# Altium project Industrial-Controller.PrjPcb (part 3 of 3)

## Sheet Industrial-Controller_Power.SchDoc: Power
size 279 x 215 mm; Date: not used; ApprovedBy: not used; CheckedBy: not used; Author: not used; CompanyName: MRobot, LCC; DrawnBy: not used; Engineer: Podlesnyi Vasilii; Organization: not used; Address1: nab. reki Karpovki, d. 5/3E; Address2: Saint-Petersburg, 197022; Address3: Ph: +7 (911) 701-51-99; Address4: not used; DocumentNumber: 0000-0000; Revision: 0.1.0; SheetNumber: 2; SheetTotal: 21; ProjectTitle: Industrial Controller; Time: not used; ImagePath: not used; Application_BuildNumber: not used
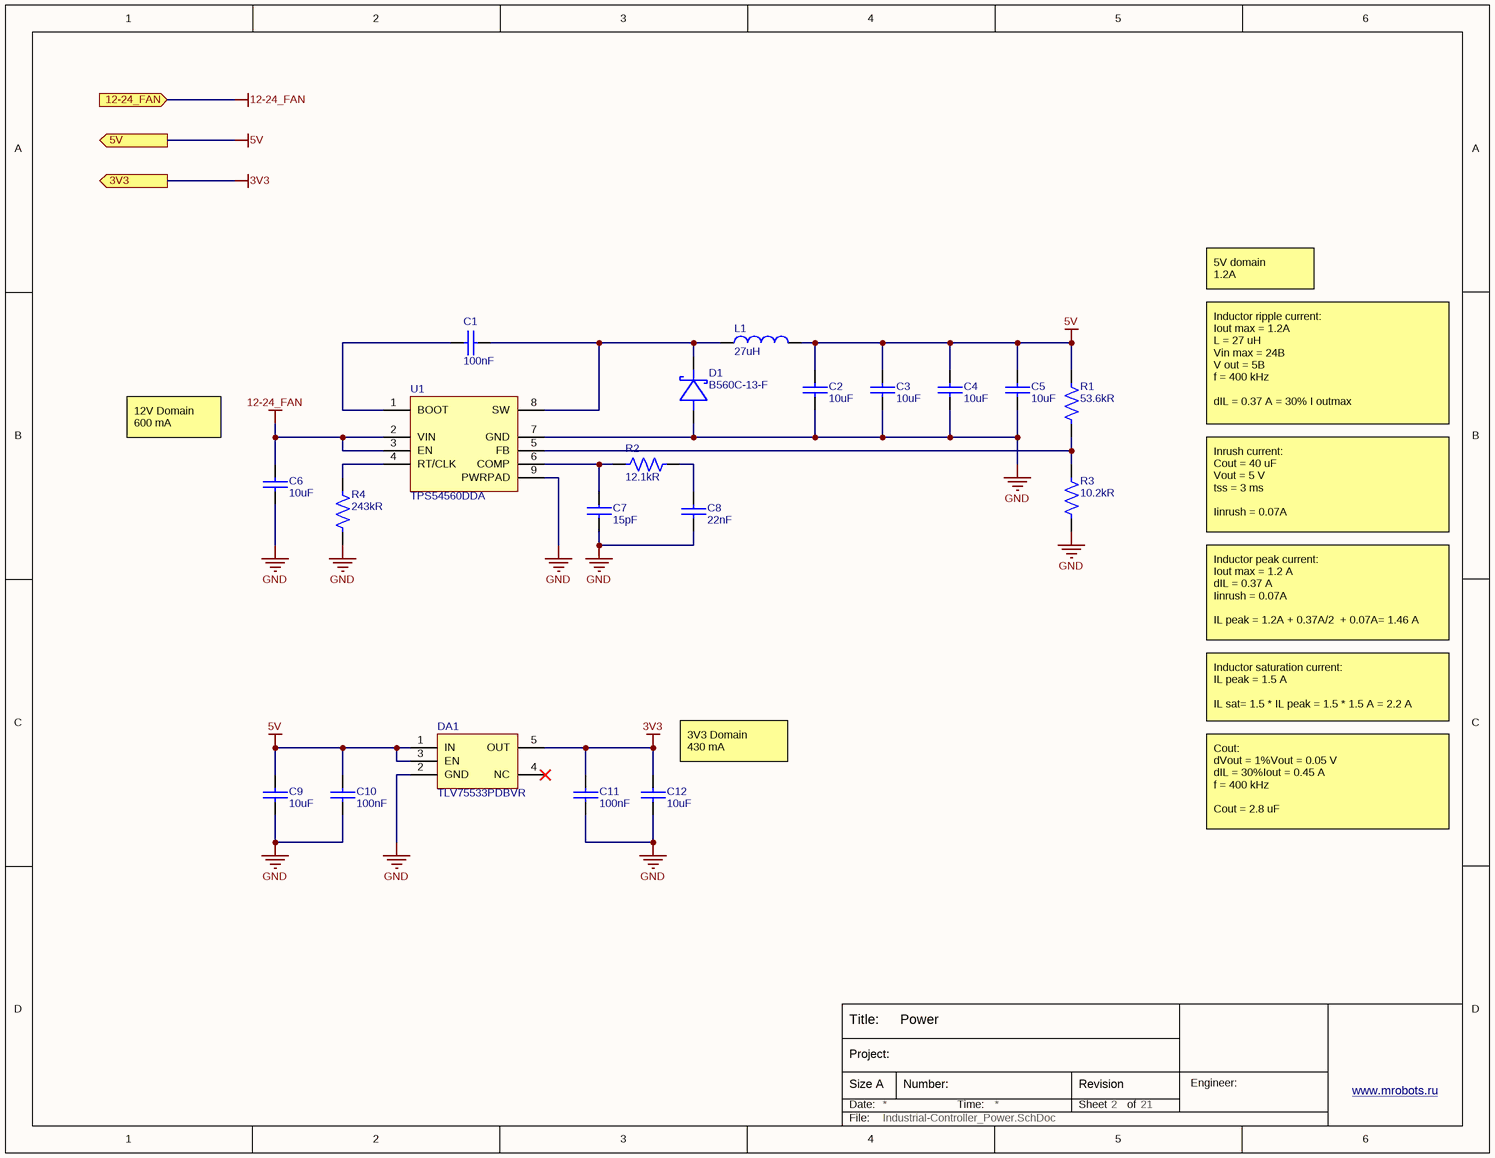
[diagram p8: Industrial-Controller_Power.SchDoc]

### Parts
C1  100nF  [CAP_0603]
C2  10uF  [CAP_1210]
C3  10uF  [CAP_1210]
C4  10uF  [CAP_1210]
C5  10uF  [CAP_1210]
C6  10uF  [CAP_1210]
C7  15pF  [CAP_0603]
C8  22nF  [CAP_0603]
C9  10uF  [CAP_1210]
C10  100nF  [CAP_0603]
C11  100nF  [CAP_0603]
C12  10uF  [CAP_1210]
D1  B560C-13-F  [SMC]
DA1  TLV75533PDBVR  [SOT-23-5]
L1  27uH  [SDR1006]
R1  53.6kR  [RES_0603]
R2  12.1kR  [RES_0603]
R3  10.2kR  [RES_0603]
R4  243kR  [RES_0603]
U1  TPS54560DDA  [SOIC-8EP_150mil]

### Ports
3V3 (out), 5V (out), 12-24_FAN (in)

### Nets
3V3: C11.1 C12.2 DA1.5(OUT) ; port 3V3
5V: C2.2 C3.2 C4.2 C5.2 C9.2 C10.1 DA1.1(IN) DA1.3(EN) L1.2 R1.1 ; port 5V
12-24_FAN: C6.2 U1.2(VIN) U1.3(EN) ; port 12-24_FAN
GND: C2.1 C3.1 C4.1 C5.1 C6.1 C7.2 C8.1 C9.1 C10.2 C11.2 C12.1 D1.2(A) DA1.2(GND) R3.2 R4.2 U1.7(GND) U1.9(PWRPAD)
NetC1_1: C1.1 U1.1(BOOT)
NetC1_2: C1.2 D1.1(C) L1.1 U1.8(SW)
NetC7_1: C7.1 R2.1 U1.6(COMP)
NetC8_2: C8.2 R2.2
NetR1_2: R1.2 R3.1 U1.5(FB)
NetR4_1: R4.1 U1.4(RT/CLK)

Not connected (* = marked no-connect by the designer): DA1 4(NC)*

### Notes on the sheet
- 5V domain
  1.2A
- 12V Domain
  600 mA
- Inductor ripple current:
  Iout max = 1.2A
  L = 27 uH
  Vin max = 24B
  V out = 5B
  f = 400 kHz
  dIL = 0.37 A = 30% I outmax
- Inrush current:
  Cout = 40 uF
  Vout = 5 V
  tss = 3 ms
  Iinrush = 0.07A
- Inductor peak current:
  Iout max = 1.2 A
  dIL = 0.37 A
  Iinrush = 0.07A
  IL peak = 1.2A + 0.37A/2  + 0.07A= 1.46 A
- (near C12) 3V3 Domain
  430 mA
- Inductor saturation current:
  IL peak = 1.5 A
  IL sat= 1.5 * IL peak = 1.5 * 1.5 A = 2.2 A
- Cout:
  dVout = 1%Vout = 0.05 V
  dIL = 30%Iout = 0.45 A
  f = 400 kHz
  Cout = 2.8 uF
- Title:
- Date:
- Size A
- Project:
- Number:
- Time:
- Sheet
- Revision
- of
- Engineer:
- www.mrobots.ru <http://mrobots.ru/>
- File:

### Library data of the parts
C1 C10 C11 = CL10B104KB8NNNL: CAP CER 0.1UF 50V X7R 0603; Manufacturer 1: Samsung; Tolerance: 10%; Supplier 1: Digi-Key; Manufacturer Part Number 1: CL10B104KB8NNNL; RoHS: Yes; Category: Ceramic Capacitors; Stock 1: 2348404; Pricing 1: 15000=0,00532, 30000=0,00506 (USD); Mount: Surface Mount; Case/Package: 0603; Min Operating Temperature: -55°C; Max Operating Temperature: 125°C; Capacitance: 100nF; Packaging: Tape and Reel; Package Quantity: 15000; Voltage Rating: 50V; Dielectric: X7R; Voltage Rating (DC): 50V; Series: CL; Construction: Flat; Length: 1.6mm; Width: 0.031inch; Height: 0.8mm; Thickness: 0.035inch; Depth: 0.8mm; Radiation Hardening: No; RoHS Compliant: Yes; ComponentLink1URL: https://datasheet.ciiva.com/26838/getdatasheetpartid-357523-26838415.pdf?src-supplier=Verical; ComponentLink1Description: https://datasheet.ciiva.com/26838/getdatasheetpartid-357523-26838415.pdf?src-supplier=Verical; ComponentLink2URL: https://datasheet.ciiva.com/25741/cl10b104kb8nnnl-25741341.pdf?src-supplier=Digi-Key; ComponentLink2Description: https://datasheet.ciiva.com/25741/cl10b104kb8nnnl-25741341.pdf?src-supplier=Digi-Key; Supplier Part Number 1: 1276-CL10B104KB8NNNLTR-ND
C2-C6 C9 C12 = CL32B106KBJNNWE: CAP CER 10UF 50V X7R 1210; Manufacturer 1: Samsung; Tolerance: 10%; Supplier 1: Digi-Key; Manufacturer Part Number 1: CL32B106KBJNNWE; RoHS: Yes; Category: Ceramic Capacitors; Stock 1: 395336; Pricing 1: 1=0,64000, 10=0,45500, 50=0,34380, 100=0,29940, 500=0,22176 (USD); Mount: Surface Mount; Case/Package: 1210; Case Code (Imperial): 1210; Case Code (Metric): 3225; Min Operating Temperature: -55°C; Max Operating Temperature: 125°C; Dielectric: X7R; Capacitance: 10uF; Voltage Rating: 50V; Package Quantity: 1; Packaging: Tape and Reel; Length: 0.126inch; Width: 0.098inch; Thickness: 0.106inch; Lead Free: Lead Free; ComponentLink1URL: https://datasheet.ciiva.com/25721/cl32b106kbjnnwe-25721651.pdf?src-supplier=Digi-Key; ComponentLink1Description: https://datasheet.ciiva.com/25721/cl32b106kbjnnwe-25721651.pdf?src-supplier=Digi-Key; Supplier Part Number 1: 1276-3388-1-ND
C7 = C0603C150J5GAC7867: CAP CER 15PF 50V C0G/NP0 0603; Manufacturer 1: KEMET; Manufacturer Part Number 1: C0603C150J5GACTU; Dielectric Material: Ceramic; Tolerance: 5%; Dielectric: C0G; Dissipation Factor: 0.1%; Temperature Coefficient: 30ppm/°C; Supplier 1: RSComponents; RoHS: Yes; Category: Ceramic Capacitors; Stock 1: 8800; Pricing 1: 50=0,02400, 500=0,01000, 2500=0,00500, 5000=0,00500, 25000=0,00400 (GBP); Mount: Surface Mount,PCB; Case/Package: 0603; Number of Pins: 2; Case Code (Imperial): 0603; Case Code (Metric): 1608; Contact Material: Tin; Min Operating Temperature: -55°C; Max Operating Temperature: 125°C; Capacitance: 15pF; Packaging: Tape and Reel; Voltage: 50V; Termination: SMD/SMT; Voltage Rating (DC): 50V; Package Quantity: 1; Voltage Rating: 50V; Series: C; Construction: Flat; Length: 1.6mm; Width: 0.8mm; Height: 0.8mm; Depth: 0.8mm; Thickness: 0.034inch; Lead Pitch: 0.7mm; Radiation Hardening: No; Lead Free: Lead Free; REACH SVHC: No SVHC; ComponentLink1URL: https://datasheet.ciiva.com/26847/getdatasheetpartid-309570-26847578.pdf?src-supplier=Verical; ComponentLink1Description: https://datasheet.ciiva.com/26847/getdatasheetpartid-309570-26847578.pdf?src-supplier=Verical; Supplier Part Number 1: 147421
C8 = CC0603KRX7R9BB223: CAP CER 0.022UF 50V X7R 0603; Manufacturer 1: Yageo; Dielectric Material: Ceramic; Tolerance: 10%; Insulation Resistance: 100GR; Supplier 1: RSComponents; RoHS: Yes; Category: Ceramic Capacitors; Stock 1: 2000; Pricing 1: 250=0,02200, 1000=0,01600, 2000=0,01400 (GBP); Mount: Surface Mount; Case/Package: 0603; Number of Pins: 2; Case Code (Metric): 1608; Case Code (Imperial): 0603; Min Operating Temperature: -55°C; Max Operating Temperature: 125°C; Capacitance: 22nF; Dielectric: X7R; Voltage: 50V; Package Quantity: 1; Voltage Rating: 50V; Packaging: Tape and Reel; Voltage Rating (DC): 50V; Termination: SMD/SMT; Resistor Type: Ceramic; Series: CC; Length: 1.6mm; Width: 0.031inch; Height: 0.8mm; Depth: 0.8mm; Thickness: 0.035inch; Radiation Hardening: No; RoHS Compliant: Yes; REACH SVHC: No SVHC; Lead Free: Lead Free; Halogen Free: Halogen Free; ComponentLink1URL: https://datasheet.ciiva.com/8033/70765-8033869.pdf?src-supplier=Element14; ComponentLink1Description: https://datasheet.ciiva.com/8033/70765-8033869.pdf?src-supplier=Element14; ComponentLink2URL: https://datasheet.ciiva.com/28450/1489800-28450639.pdf?src-supplier=Element14; ComponentLink2Description: https://datasheet.ciiva.com/28450/1489800-28450639.pdf?src-supplier=Element14; ComponentLink3URL: https://datasheet.ciiva.com/8033/1489800-8033867.pdf?src-supplier=Element14; ComponentLink3Description: https://datasheet.ciiva.com/8033/1489800-8033867.pdf?src-supplier=Element14; ComponentLink4URL: https://datasheet.ciiva.com/8033/1489800-8033865.pdf?src-supplier=Element14; ComponentLink4Description: https://datasheet.ciiva.com/8033/1489800-8033865.pdf?src-supplier=Element14; ComponentLink5URL: https://datasheet.ciiva.com/156/mlccorderingcode-156178.pdf?src-supplier=Digi-Key; ComponentLink5Description: https://datasheet.ciiva.com/156/mlccorderingcode-156178.pdf?src-supplier=Digi-Key; ComponentLink6URL: https://datasheet.ciiva.com/156/mlccorderingcode-156177.pdf?src-supplier=Digi-Key; ComponentLink6Description: https://datasheet.ciiva.com/156/mlccorderingcode-156177.pdf?src-supplier=Digi-Key; ComponentLink7URL: https://datasheet.ciiva.com/156/mlccorderingcode-156179.pdf?src-supplier=Digi-Key; ComponentLink7Description: https://datasheet.ciiva.com/156/mlccorderingcode-156179.pdf?src-supplier=Digi-Key; ComponentLink8URL: https://datasheet.ciiva.com/11464/upy-gphc-x7r-6-3v-to-50v-8-11464741.pdf?src-supplier=Avnet; ComponentLink8Description: https://datasheet.ciiva.com/11464/upy-gphc-x7r-6-3v-to-50v-8-11464741.pdf?src-supplier=Avnet; Supplier Part Number 1: 2006607; Manufacturer Part Number 1: CC0603KRX7R9BB223
D1 = B560C-13-F: DIODE SCHOTTKY 60V 5A SMC; Manufacturer 1: Diodes; Max Reverse Current: 500uA; Peak Non-Repetitive Surge Current: 100A; Element Configuration: Single; Polarity: Standard; Forward Voltage: 700mV; Capacitance: 300pF; Supplier 1: RSComponents; RoHS: Yes; Category: Rectifier Diodes; Stock 1: 60660; Pricing 1: 100=0,28800, 200=0,27300, 750=0,26000, 1500=0,22000 (GBP); Mount: Surface Mount; Case/Package: SMC; Number of Pins: 2; Weight: 0.007408oz; Contact Plating: Tin,Matte; Min Operating Temperature: -55°C; Max Operating Temperature: 125°C; Package Quantity: 3000; Packaging: Tape and Reel; Forward Current: 5A; Max Repetitive Reverse Voltage (Vrrm): 60V; Output Current: 5A; Series: -; Max Forward Surge Current (Ifsm): 100A; Average Rectified Current: 5A; Termination: SMD/SMT; Voltage Rating (DC): 60V; Current Rating: 5A; Max Reverse Voltage (DC): 60V; Length: 7.11mm; Width: 6.22mm; Height: 2.5mm; Radiation Hardening: No; Lead Free: Lead Free; RoHS Compliant: Yes; REACH SVHC: No SVHC; ComponentLink1URL: https://datasheet.ciiva.com/27052/1538961-27052355.pdf?src-supplier=Jameco; ComponentLink1Description: https://datasheet.ciiva.com/27052/1538961-27052355.pdf?src-supplier=Jameco; ComponentLink2URL: https://datasheet.ciiva.com/1177/ds13012-1177532.pdf?src-supplier=Element14; ComponentLink2Description: https://datasheet.ciiva.com/1177/ds13012-1177532.pdf?src-supplier=Element14; ComponentLink3URL: https://datasheet.ciiva.com/16389/ds13012-16389735.pdf?src-supplier=Future+Electronics; ComponentLink3Description: https://datasheet.ciiva.com/16389/ds13012-16389735.pdf?src-supplier=Future+Electronics; ComponentLink4URL: https://datasheet.ciiva.com/15144/getdatasheetpartid-89786-15144652.pdf?src-supplier=Verical; ComponentLink4Description: https://datasheet.ciiva.com/15144/getdatasheetpartid-89786-15144652.pdf?src-supplier=Verical; ComponentLink5URL: https://datasheet.ciiva.com/914/ds13012-914986.pdf?src-supplier=Digi-Key; ComponentLink5Description: https://datasheet.ciiva.com/914/ds13012-914986.pdf?src-supplier=Digi-Key; ComponentLink6URL: https://datasheet.ciiva.com/914/ds13012-914987.pdf?src-supplier=Digi-Key; ComponentLink6Description: https://datasheet.ciiva.com/914/ds13012-914987.pdf?src-supplier=Digi-Key; ComponentLink7URL: https://datasheet.ciiva.com/914/ds13012-914985.pdf?src-supplier=Digi-Key; ComponentLink7Description: https://datasheet.ciiva.com/914/ds13012-914985.pdf?src-supplier=Digi-Key; Supplier Part Number 1: 7513301P; Manufacturer Part Number 1: B560C-13-F
DA1 = TLV75533PDBVR: IC REG LINEAR 3.3V 500MA SOT23-5; Manufacturer 1: Texas Instruments; Output Type: Fixed; Output Configuration: Positive; Number of Regulators: 1; Max Input Voltage: 5.5V; Dropout Voltage: 238mV; Quiescent Current: 31uA; Power Supply Rejection Ratio (PSRR): 52dB; Supplier 1: Mouser; RoHS: Yes; Category: Voltage Regulators - Linear; Stock 1: 90; Pricing 1: 1=0,46000, 10=0,39400, 50=0,39400, 100=0,27300, 1000=0,17900, 10000=0,16200 (USD); Mount: Surface Mount; Case/Package: SOT-23-5; Min Operating Temperature: -40°C; Max Operating Temperature: 125°C; Packaging: Cut Tape; Min Output Voltage: 3.3V; Max Output Voltage: 3.3V; Output Current: 500mA; RoHS Compliant: Yes; ComponentLink1URL: http://www.ti.com/lit/ds/symlink/tlv755p.pdf?src-supplier=Digi-Key; ComponentLink1Description: http://www.ti.com/lit/ds/symlink/tlv755p.pdf?src-supplier=Digi-Key; ComponentLink2URL: http://www.ti.com/general/docs/suppproductinfo.tsp?distId=10&amp;gotoUrl=http%3A%2F%2Fwww.ti.com%2Flit%2Fgpn%2Ftlv755p&src-supplier=Digi-Key; ComponentLink2Description: http://www.ti.com/general/docs/suppproductinfo.tsp?distId=10&amp;gotoUrl=http%3A%2F%2Fwww.ti.com%2Flit%2Fgpn%2Ftlv755p&src-supplier=Digi-Key; Supplier Part Number 1: 595-TLV75533PDBVR; Manufacturer Part Number 1: TLV75533PDBVR
L1 = SDR1006-270KL: FIXED IND 27UH 1.75A 110MOHM SMD; Manufacturer 1: Bourns; Core Material: Ferrite; Self Resonant Frequency: 11MHz; Tolerance: 10%; Q Factor: 25; Saturation Current: 3.4A; Shielding: Unshielded; Resistance: 110MR; Test Frequency: 1kHz; Supplier 1: RSComponents; RoHS: Yes; Category: Fixed Inductors; Stock 1: 650; Pricing 1: 5=0,80000, 25=0,74400, 50=0,69600, 100=0,66400, 200=0,59200 (GBP); Mount: Surface Mount; Case/Package: Nonstandard; Min Operating Temperature: -40°C; Max Operating Temperature: 125°C; Packaging: Tape and Reel; Inductance Tolerance: 10%; Package Quantity: 800; Current Rating: 1.75A; Inductance: 27uH; Resistor Type: Wirewound; DC Resistance (DCR): 110mR; Max DC Current: 1.75A; Termination: SMD/SMT; DC Current: 1.75A; RMS Current (Irms): 1.75A; Series: SDR1006; Sample Rate (Hz): 1kHz; Diameter: 9.8mm; Length: 0.386inch; Width: 0.386inch; Height: 5.8mm; Height - Seated (Max): 0.228inch; Radiation Hardening: No; REACH SVHC: No SVHC; Military Standard: Not; RoHS Compliant: Yes; ComponentLink1URL: https://datasheet.ciiva.com/11802/0900766b80f2b5eb-11802788.pdf?src-supplier=RSComponents; ComponentLink1Description: https://datasheet.ciiva.com/11802/0900766b80f2b5eb-11802788.pdf?src-supplier=RSComponents; ComponentLink2URL: https://datasheet.ciiva.com/1049/sdr1006-1049700.pdf?src-supplier=Digi-Key; ComponentLink2Description: https://datasheet.ciiva.com/1049/sdr1006-1049700.pdf?src-supplier=Digi-Key; ComponentLink3URL: https://datasheet.ciiva.com/1049/sdr1006-1049701.pdf?src-supplier=Digi-Key; ComponentLink3Description: https://datasheet.ciiva.com/1049/sdr1006-1049701.pdf?src-supplier=Digi-Key; ComponentLink4URL: https://datasheet.ciiva.com/1049/sdr1006-1049702.pdf?src-supplier=Digi-Key; ComponentLink4Description: https://datasheet.ciiva.com/1049/sdr1006-1049702.pdf?src-supplier=Digi-Key; ComponentLink5URL: https://datasheet.ciiva.com/8515/sdr1006-8515561.pdf?src-supplier=Avnet; ComponentLink5Description: https://datasheet.ciiva.com/8515/sdr1006-8515561.pdf?src-supplier=Avnet; ComponentLink6URL: https://datasheet.ciiva.com/46435/1695385-46435131.pdf?src-supplier=Element14; ComponentLink6Description: https://datasheet.ciiva.com/46435/1695385-46435131.pdf?src-supplier=Element14; ComponentLink7URL: https://datasheet.ciiva.com/31841/sdr1006-31841678.pdf?src-supplier=Onlinecomponents.com; ComponentLink7Description: https://datasheet.ciiva.com/31841/sdr1006-31841678.pdf?src-supplier=Onlinecomponents.com; ComponentLink8URL: https://datasheet.ciiva.com/16959/70153529-16959295.pdf?src-supplier=Allied+Electronics; ComponentLink8Description: https://datasheet.ciiva.com/16959/70153529-16959295.pdf?src-supplier=Allied+Electronics; ComponentLink9URL: https://datasheet.ciiva.com/41452/001056199-da-01-en-leis-indukt-sdr1006-270kl-27uh-1-75a-41452039.pdf?src-supplier=Conrad; ComponentLink9Description: https://datasheet.ciiva.com/41452/001056199-da-01-en-leis-indukt-sdr1006-270kl-27uh-1-75a-41452039.pdf?src-supplier=Conrad; Supplier Part Number 1: 7271707; Manufacturer Part Number 1: SDR1006-270KL
R1 = RC0603FR-0753K6L: RES 53.6K OHM 1% 1/10W 0603; Manufacturer 1: Yageo; Temperature Coefficient: 100ppm/°C; Voltage Rating (DC): 50V; Power Rating: 100mW; Supplier 1: Arrow Electronics; RoHS: Yes; Category: Chip SMD Resistors; Stock 1: 8950; Pricing 1: 1=0,05320, 10=0,01340, 25=0,01240, 100=0,00690, 250=0,00650, 500=0,00530, 1000=0,00400, 3000=0,00300, 6000=0,00270 (USD); Mount: Surface Mount; Case/Package: 0603; Case Code (Imperial): 0603; Case Code (Metric): 1608; Size Code: 0603; Min Operating Temperature: -55°C; Max Operating Temperature: 155°C; Packaging: Tape and Reel; Resistance: 53.6kR; Tolerance: 1%; Resistor Type: Thick Film; Voltage Rating: 50V; Termination: SMD/SMT; Features: Moisture Resistant; Series: RC; Max Power Dissipation: 100mW; Number of Terminations: 2; Construction: Rectangular; Technology: THICK FILM; Length: 1.6mm; Height: 0.45mm; Depth: 0.8mm; Lead Free: Lead Free; Military Standard: Not; RoHS Compliant: Yes; ComponentLink1URL: https://datasheet.ciiva.com/11819/0900766b80f96399-11819394.pdf?src-supplier=RSComponents; ComponentLink1Description: https://datasheet.ciiva.com/11819/0900766b80f96399-11819394.pdf?src-supplier=RSComponents; Supplier Part Number 1: RC0603FR-0753K6L; Manufacturer Part Number 1: RC0603FR-0753K6L
R2 = RC0603FR-0712K1L: RES 12.1K OHM 1% 1/10W 0603; Manufacturer 1: Yageo; Power Rating: 100mW; Temperature Coefficient: 100ppm/°C; Voltage Rating: 50V; Supplier 1: Digi-Key; Manufacturer Part Number 1: RC0603FR-0712K1L; RoHS: Yes; Category: Chip SMD Resistors; Stock 1: 225707; Pricing 1: 1=0,10000, 10=0,02400, 100=0,00970, 1000=0,00436, 2500=0,00378 (USD); Case/Package: 0603; Number of Pins: 2; Case Code (Metric): 1608; Case Code (Imperial): 0603; Size Code: 0603; Min Operating Temperature: -55°C; Max Operating Temperature: 155°C; Tolerance: 1%; Series: RC; Package Quantity: 1; Resistance: 12.1kR; Packaging: Tape and Reel; Resistor Type: Thick Film; Number of Terminations: 2; Termination: SMD/SMT; Max Power Dissipation: 100mW; Voltage Rating (DC): 50V; Features: Moisture Resistant; Resistance Tolerance: 1%; Construction: Rectangular; Length: 1.6mm; Width: 0.031inch; Height: 0.022inch; Depth: 0.8mm; RoHS Compliant: Yes; REACH SVHC: No SVHC; Military Standard: Not; Lead Free: Lead Free; ComponentLink1URL: https://datasheet.ciiva.com/2519/pyu-r-int-thick-7-2519217.pdf?src-supplier=Digi-Key; ComponentLink1Description: https://datasheet.ciiva.com/2519/pyu-r-int-thick-7-2519217.pdf?src-supplier=Digi-Key; ComponentLink2URL: https://datasheet.ciiva.com/2519/pyu-r-int-thick-7-2519218.pdf?src-supplier=Digi-Key; ComponentLink2Description: https://datasheet.ciiva.com/2519/pyu-r-int-thick-7-2519218.pdf?src-supplier=Digi-Key; ComponentLink3URL: https://datasheet.ciiva.com/15159/getdatasheetpartid-28802-15159207.pdf?src-supplier=Verical; ComponentLink3Description: https://datasheet.ciiva.com/15159/getdatasheetpartid-28802-15159207.pdf?src-supplier=Verical; ComponentLink4URL: https://datasheet.ciiva.com/12558/rc0603-272842-12558574.pdf?src-supplier=Mouser; ComponentLink4Description: https://datasheet.ciiva.com/12558/rc0603-272842-12558574.pdf?src-supplier=Mouser; ComponentLink5URL: https://datasheet.ciiva.com/2519/pyu-r-int-thick-7-2519216.pdf?src-supplier=Digi-Key; ComponentLink5Description: https://datasheet.ciiva.com/2519/pyu-r-int-thick-7-2519216.pdf?src-supplier=Digi-Key; ComponentLink6URL: https://datasheet.ciiva.com/46395/443971-46395022.pdf?src-supplier=Element14; ComponentLink6Description: https://datasheet.ciiva.com/46395/443971-46395022.pdf?src-supplier=Element14; Supplier Part Number 1: 311-12.1KHRCT-ND
R3 = RC0603FR-0710K2L: RES 10.2K OHM 1% 1/10W 0603; Manufacturer 1: Yageo; Power Rating: 100mW; Voltage Rating: 75V; Temperature Coefficient: 100ppm/°C; Voltage Rating (DC): 50V; Supplier 1: Arrow Electronics; RoHS: Yes; Category: Chip SMD Resistors; Stock 1: 45000; Pricing 1: 5000=0,00250, 10000=0,00220, 25000=0,00190, 50000=0,00170, 125000=0,00120 (USD); Mount: Surface Mount; Case/Package: 0603; Case Code (Metric): 1608; Case Code (Imperial): 0603; Weight: 7.1E-05oz; Size Code: 0603; Min Operating Temperature: -55°C; Max Operating Temperature: 155°C; Package Quantity: 1; Resistance: 10.2kR; Tolerance: 1%; Packaging: Tape and Reel; Resistor Type: Thick Film; Number of Terminations: 2; Termination: SMD/SMT; Max Power Dissipation: 100mW; Features: Moisture Resistant; Series: RC; Construction: Rectangular; Technology: THICK FILM; Length: 1.6mm; Width: 0.031inch; Height: 0.45mm; Depth: 0.8mm; Military Standard: Not; Lead Free: Lead Free; RoHS Compliant: Yes; ComponentLink1URL: https://datasheet.ciiva.com/11819/0900766b80f96399-11819227.pdf?src-supplier=RSComponents; ComponentLink1Description: https://datasheet.ciiva.com/11819/0900766b80f96399-11819227.pdf?src-supplier=RSComponents; ComponentLink2URL: https://datasheet.ciiva.com/2455/pyu-r-int-thick-7-2455183.pdf?src-supplier=Digi-Key; ComponentLink2Description: https://datasheet.ciiva.com/2455/pyu-r-int-thick-7-2455183.pdf?src-supplier=Digi-Key; ComponentLink3URL: https://datasheet.ciiva.com/2455/pyu-r-int-thick-7-2455184.pdf?src-supplier=Digi-Key; ComponentLink3Description: https://datasheet.ciiva.com/2455/pyu-r-int-thick-7-2455184.pdf?src-supplier=Digi-Key; ComponentLink4URL: https://datasheet.ciiva.com/2455/pyu-r-int-thick-7-2455182.pdf?src-supplier=Digi-Key; ComponentLink4Description: https://datasheet.ciiva.com/2455/pyu-r-int-thick-7-2455182.pdf?src-supplier=Digi-Key; Supplier Part Number 1: RC0603FR-0710K2L; Manufacturer Part Number 1: RC0603FR-0710K2L
R4 = RC0603FR-07243KL: RES 243K OHM 1% 1/10W 0603; Manufacturer 1: Yageo; Power Rating: 100mW; Temperature Coefficient: 100ppm/°C; Voltage Rating: 50V; Working Voltage: 75V; Supplier 1: Arrow Electronics; RoHS: Yes; Category: Chip SMD Resistors; Stock 1: 5000; Pricing 1: 5000=0,00270, 10000=0,00250, 25000=0,00220, 50000=0,00200, 125000=0,00190 (USD); Case/Package: 0603; Case Code (Imperial): 0603; Case Code (Metric): 1608; Min Operating Temperature: -55°C; Max Operating Temperature: 155°C; Tolerance: 1%; Series: RC; Technology: THICK FILM; Packaging: Tape and Reel; Package Quantity: 1; Resistance: 243kR; Termination: SMD/SMT; Resistor Type: Thick Film; Number of Terminations: 2; Max Power Dissipation: 100mW; Voltage Rating (DC): 50V; Features: Moisture Resistant; Construction: Rectangular; Length: 1.6mm; Width: 0.8mm; Height: 0.022inch; Depth: 0.8mm; Military Standard: Not; Lead Free: Lead Free; RoHS Compliant: Yes; ComponentLink1URL: https://datasheet.ciiva.com/2454/pyu-r-int-thick-7-2454154.pdf?src-supplier=Digi-Key; ComponentLink1Description: https://datasheet.ciiva.com/2454/pyu-r-int-thick-7-2454154.pdf?src-supplier=Digi-Key; ComponentLink2URL: https://datasheet.ciiva.com/2454/pyu-r-int-thick-7-2454155.pdf?src-supplier=Digi-Key; ComponentLink2Description: https://datasheet.ciiva.com/2454/pyu-r-int-thick-7-2454155.pdf?src-supplier=Digi-Key; ComponentLink3URL: https://datasheet.ciiva.com/2454/pyu-r-int-thick-7-2454153.pdf?src-supplier=Digi-Key; ComponentLink3Description: https://datasheet.ciiva.com/2454/pyu-r-int-thick-7-2454153.pdf?src-supplier=Digi-Key; ComponentLink4URL: https://datasheet.ciiva.com/12558/rc0603-272842-12558677.pdf?src-supplier=Mouser; ComponentLink4Description: https://datasheet.ciiva.com/12558/rc0603-272842-12558677.pdf?src-supplier=Mouser; Supplier Part Number 1: RC0603FR-07243KL; Manufacturer Part Number 1: RC0603FR-07243KL
U1 = TPS54560DDA: IC REG BCK SPLIT RAIL ADJ 8SOPWR; Manufacturer 1: Texas Instruments; Max Input Voltage: 60V; Output Voltage: 58.8V; Min Input Voltage: 4.5V; Number of Outputs: 1; Max Output Current: 5A; Switching Frequency: 2.5MHz; Min Output Voltage: 800mV; Synchronous Rectifier: No; Quiescent Current: 146uA; Output Type: Adjustable; Output Configuration: Positive; Supplier 1: Mouser; RoHS: Yes; Category: Voltage Regulators - Switching; Stock 1: 12786; Pricing 1: 1=6,86000, 10=6,15000, 50=5,81000, 100=5,04000, 1000=4,29000, 10000=3,75000 (USD); Mount: Surface Mount; Case/Package: HSOP; Number of Pins: 8; Weight: 0.00249oz; Min Operating Temperature: -40°C; Max Operating Temperature: 125°C; Output Current: 5A; Packaging: Rail/Tube; Package Quantity: 75; Min Supply Voltage: 4.5V; Max Output Voltage: 58.8V; Series: Eco-Mode™; Length: 5mm; Width: 4mm; Height: 1.55mm; Radiation Hardening: No; REACH SVHC: No SVHC; Lead Free: Lead Free; RoHS Compliant: Yes; ComponentLink1URL: https://datasheet.ciiva.com/23789/tps54560-23789344.pdf?src-supplier=Newark; ComponentLink1Description: https://datasheet.ciiva.com/23789/tps54560-23789344.pdf?src-supplier=Newark; ComponentLink2URL: https://datasheet.ciiva.com/22669/1857574-22669207.pdf?src-supplier=Element14; ComponentLink2Description: https://datasheet.ciiva.com/22669/1857574-22669207.pdf?src-supplier=Element14; ComponentLink3URL: https://datasheet.ciiva.com/15081/tps54560-15081918.pdf?src-supplier=Digi-Key; ComponentLink3Description: https://datasheet.ciiva.com/15081/tps54560-15081918.pdf?src-supplier=Digi-Key; ComponentLink4URL: https://datasheet.ciiva.com/29882/tps54560-29882313.pdf?src-supplier=Avnet; ComponentLink4Description: https://datasheet.ciiva.com/29882/tps54560-29882313.pdf?src-supplier=Avnet; Supplier Part Number 1: 595-TPS54560DDA; Manufacturer Part Number 1: TPS54560DDA

## Nets that join several sheets
3V3: Industrial-Controller_MCU (13 pins), Industrial-Controller_Temperature (J4.1 J5.1 R20.1 R21.1), Industrial-Controller_USB (R12.1), Industrial-Controller_ESP8266 (9 pins), Isolated inputs1 (R15A.1), Isolated inputs2 (R15B.1), Isolated inputs3 (R15C.1), Industrial-Controller_Fan (R27.1), Industrial-Controller_Power (C11.1 C12.2 DA1.5)
5V: Isolated inputs1 (D2A.1 R16A.1), Isolated inputs2 (D2B.1 R16B.1), Isolated inputs3 (D2C.1 R16C.1), Relays1 (D3A.1 K1A.A1), Relays2 (D3B.1 K1B.A1), Relays3 (D3C.1 K1C.A1), Relays4 (D3D.1 K1D.A1), Industrial-Controller_Power (10 pins)
12-24_FAN: Industrial-Controller_Fan (C27.1 FB1.1 J7.2), Industrial-Controller_Power (C6.2 U1.2 U1.3)
GND: Industrial-Controller_MCU (18 pins), Industrial-Controller_Temperature (D5.2 D6.2 J4.3 J5.3), Industrial-Controller_USB (J1.4 J1.5 U4.2), Industrial-Controller_ESP8266 (6 pins), Isolated inputs1 (C22A.2 DA2A.3 J2A.2), Isolated inputs2 (C22B.2 DA2B.3 J2B.2), Isolated inputs3 (C22C.2 DA2C.3 J2C.2), Relays1 (D4A.2 Q1A.2 R19A.2), Relays2 (D4B.2 Q1B.2 R19B.2), Relays3 (D4C.2 Q1C.2 R19C.2), Relays4 (D4D.2 Q1D.2 R19D.2), Industrial-Controller_Fan (8 pins), Industrial-Controller_Power (17 pins)
ESP_BOOT: Industrial-Controller_MCU (U2.30), Industrial-Controller_ESP8266 (R24.2 U5.18)
ESP_ENABLE: Industrial-Controller_MCU (U2.22), Industrial-Controller_ESP8266 (R22.2 U5.3)
ESP_RESET: Industrial-Controller_MCU (U2.16), Industrial-Controller_ESP8266 (R23.2 U5.1)
MCU_PWM_FAN: Industrial-Controller_MCU (U2.29), Industrial-Controller_Fan (D8.1 J8.2 R29.1)
MCU_RPM_FAN: Industrial-Controller_MCU (U2.38), Industrial-Controller_Fan (R28.2)
MCU_USB_D_N: Industrial-Controller_MCU (U2.32), Industrial-Controller_USB (R13.1)
MCU_USB_D_P: Industrial-Controller_MCU (U2.33), Industrial-Controller_USB (R14.1)
USART1_TEMP1: Industrial-Controller_MCU (U2.42 U2.43), Industrial-Controller_Temperature (D5.1 J4.2 R20.2)
USART2_ESP_RX: Industrial-Controller_MCU (R6.1), Industrial-Controller_ESP8266 (U5.21)
USART2_ESP_TX: Industrial-Controller_MCU (R5.1), Industrial-Controller_ESP8266 (U5.22)
USART2_TEMP2: Industrial-Controller_MCU (R7.1 R8.1), Industrial-Controller_Temperature (D6.1 J5.2 R21.2)